# Altium schematic sheet CPU.SchDoc: IC
size A4; DrawnBy: Mauro De Bruyn; Revision: 1; SheetNumber: 2; SheetTotal: 5; Number: PXL Project soldeerbout
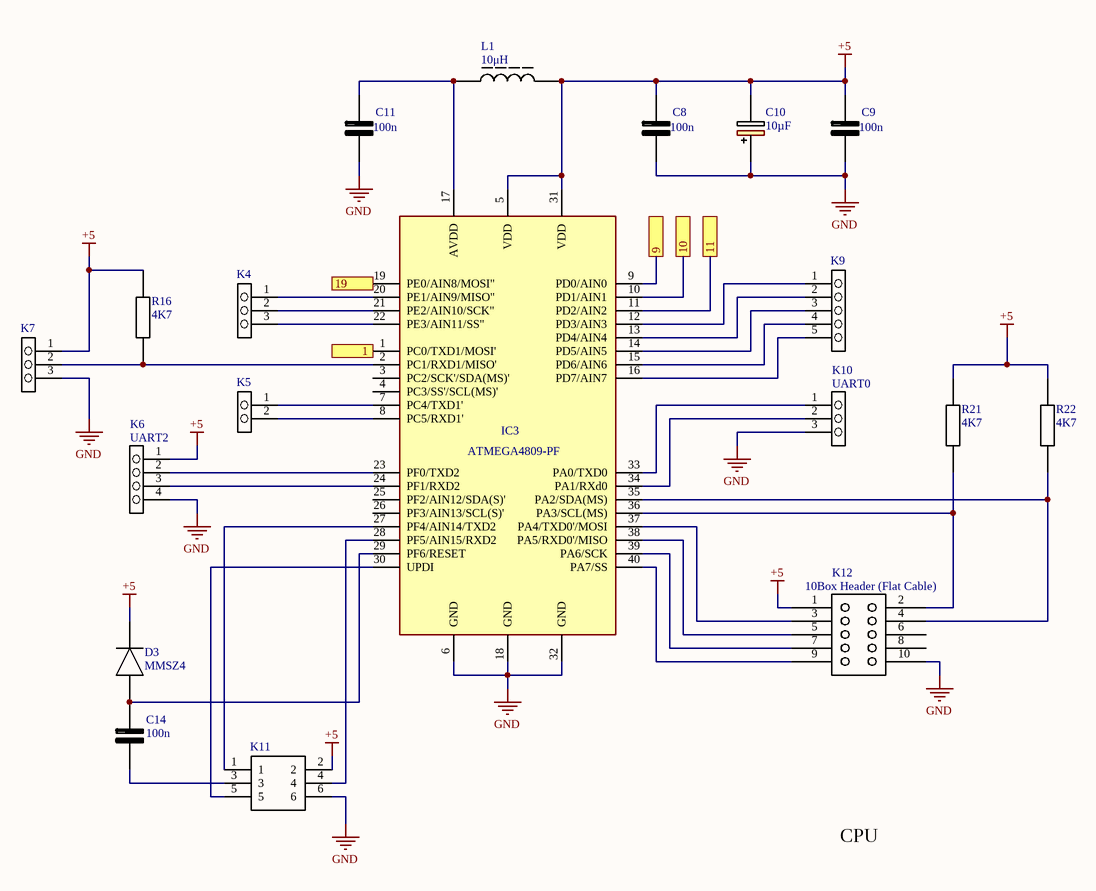
[diagram p0: CPU.SchDoc]

## Parts
C8  100n  [C0805]
C9  100n  [C0805]
C10  10µF  [CAPPRD200W52D500H1250]
C11  100n  [C0805]
C14  100n  [C0805]
D3  MMSZ4  [SOD2512X110N]
IC3  ATMEGA4809-PF  [DIP1543W58P254L5175H635Q40N]
K4  M20-9990345  [HDRV3W64P0X254_1X3_762X254X864P]  (value not drawn)
K5  M20-9990246  [HDRV2W66P0X254_1X2_508X254X874P]  (value not drawn)
K6  UART2  [HDRV4W64P0X254_1X4_1016X254X834P]
K7  M20-9990345  [HDRV3W64P0X254_1X3_762X254X864P]  (value not drawn)
K9  M20-9990545  [HDRV5W64P0X254_1X5_1270X254X864P]  (value not drawn)
K10  UART0  [HDRV3W64P0X254_1X3_762X254X864P]
K11  M20-9760342  [HDRV6W66P254_2X3_762X508X830P]  (value not drawn)
K12  10Box Header (Flat Cable)  [10BoxHeader]
L1  10μH  [VLS56045]
R16  4K7  [C0805]
R21  4K7  [C0805]
R22  4K7  [C0805]

## Ports
1, 9, 10, 11, 19

## Nets
+5: C8.2(-) C9.2(-) C10.2(-) D3.1(K) IC3.5(VDD) IC3.31(VDD) K6.1 K7.1 K11.2 K12.1 L1.2 R16.2 R21.2 R22.2
GND: C8.1(+) C9.1(+) C10.1(+) C11.1(+) IC3.6(GND) IC3.18(GND) IC3.32(GND) K6.4 K7.3 K10.3 K11.6 K12.10
1: IC3.1(PC0/TXD1/MOSI') ; port 1
9: IC3.9(PD0/AIN0) ; port 9
10: IC3.10(PD1/AIN1) ; port 10
11: IC3.11(PD2/AIN2) ; port 11
19: IC3.19(PE0/AIN8/MOSI") ; port 19
NetC11_2: C11.2(-) IC3.17(AVDD) L1.1
NetC14_1: C14.1(+) K11.3
NetC14_2: C14.2(-) D3.2(A) IC3.29(PF6/RESET)
NetIC3_2: IC3.2(PC1/RXD1/MISO') K7.2 R16.1
NetIC3_7: IC3.7(PC4/TXD1') K5.1
NetIC3_8: IC3.8(PC5/RXD1') K5.2
NetIC3_12: IC3.12(PD3/AIN3) K9.1
NetIC3_13: IC3.13(PD4/AIN4) K9.2
NetIC3_14: IC3.14(PD5/AIN5) K9.3
NetIC3_15: IC3.15(PD6/AIN6) K9.4
NetIC3_16: IC3.16(PD7/AIN7) K9.5
NetIC3_20: IC3.20(PE1/AIN9/MISO") K4.1
NetIC3_21: IC3.21(PE2/AIN10/SCK") K4.2
NetIC3_22: IC3.22(PE3/AIN11/SS") K4.3
NetIC3_23: IC3.23(PF0/TXD2) K6.2
NetIC3_24: IC3.24(PF1/RXD2) K6.3
NetIC3_27: IC3.27(PF4/AIN14/TXD2) K11.1
NetIC3_28: IC3.28(PF5/AIN15/RXD2) K11.4
NetIC3_30: IC3.30(UPDI) K11.5
NetIC3_33: IC3.33(PA0/TXD0) K10.1
NetIC3_34: IC3.34(PA1/RXd0) K10.2
NetIC3_35: IC3.35(PA2/SDA(MS)) K12.4 R22.1
NetIC3_36: IC3.36(PA3/SCL(MS)) K12.2 R21.1
NetIC3_37: IC3.37(PA4/TXD0'/MOSI) K12.3
NetIC3_38: IC3.38(PA5/RXD0'/MISO) K12.5
NetIC3_39: IC3.39(PA6/SCK) K12.7
NetIC3_40: IC3.40(PA7/SS) K12.9

Not connected (* = marked no-connect by the designer): IC3 3(PC2/SCK'/SDA(MS)') 4(PC3/SS'/SCL(MS)') 25(PF2/AIN12/SDA(S)') 26(PF3/AIN13/SCL(S)'); K12 6 8

## Notes on the sheet
- CPU

## Library data of the parts
C8 C9 C11 C14 = 0805_1: Capacitor; Manufacturer_Name: Kemet; Manufacturer_Part_Number: C0805C391G3GACTU; Datasheet Link: https://content.kemet.com/datasheets/KEM_C1003_C0G_SMD.pdf; Height: 1.1mm
C10 = 860020672010: Capacitor Polarised; Manufacturer_Name: Wurth Elektronik; Datasheet Link: https://componentsearchengine.com//860020672010.pdf; Height: 12.5mm; Mouser2 Part Number: 710-860020672010; Mouser2 Price/Stock: https://www.mouser.com/Search/Refine.aspx?Keyword=710-860020672010; Manufacturer_Part_Number: 860020672010
D3 = SMMDL914T1G: Diode; Manufacturer_Name: ON Semiconductor; Datasheet Link: https://componentsearchengine.com//SMMDL914T1G.pdf; Height: 1.1mm; Mouser2 Part Number: 863-SMMDL914T1G; Mouser2 Price/Stock: https://www.mouser.com/Search/Refine.aspx?Keyword=863-SMMDL914T1G; Manufacturer_Part_Number: SMMDL914T1G
IC3 = ATMEGA4809-PF: Integrated Circuit; Manufacturer_Name: Microchip; Datasheet Link: https://componentsearchengine.com//ATMEGA4809-PF.pdf; Height: 6.35mm; Mouser2 Part Number: 556-ATMEGA4809-PF; Mouser2 Price/Stock: https://www.mouser.com/Search/Refine.aspx?Keyword=556-ATMEGA4809-PF; Manufacturer_Part_Number: ATMEGA4809-PF
K4 K7 K10 = M20-9990345: Connector 3-PIN; Manufacturer_Name: Harwin; Datasheet Link: https://componentsearchengine.com//M20-9990345.pdf; Height: 8.64mm; Mouser2 Part Number: 855-M20-9990345; Mouser2 Price/Stock: https://www.mouser.com/Search/Refine.aspx?Keyword=855-M20-9990345; Manufacturer_Part_Number: M20-9990345
K5 = M20-9990246: Connector 2-PIN; Manufacturer_Name: Harwin; Datasheet Link: https://componentsearchengine.com//M20-9990246.pdf; Height: 8.74mm; Mouser2 Part Number: 855-M20-9990246; Mouser2 Price/Stock: https://www.mouser.com/Search/Refine.aspx?Keyword=855-M20-9990246; Manufacturer_Part_Number: M20-9990246
K6 = M20-9770446: Connector 4-PIN; Manufacturer_Name: Harwin; Datasheet Link: https://componentsearchengine.com//M20-9770446.pdf; Height: 8.34mm; Mouser2 Part Number: 855-M20-9770446; Mouser2 Price/Stock: https://www.mouser.com/Search/Refine.aspx?Keyword=855-M20-9770446; Manufacturer_Part_Number: M20-9770446
K9 = M20-9990545: Connector 5-PIN; Manufacturer_Name: Harwin; Datasheet Link: https://componentsearchengine.com//M20-9990545.pdf; Height: 8.64mm; Mouser2 Part Number: 855-M20-9990545; Mouser2 Price/Stock: https://www.mouser.com/Search/Refine.aspx?Keyword=855-M20-9990545; Manufacturer_Part_Number: M20-9990545
K11 = M20-9760342: Connector 6-PIN; Manufacturer_Name: Harwin; Datasheet Link: https://cdn.harwin.com/pdfs/M20-976.pdf; Height: 8.3mm; Manufacturer_Part_Number: M20-9760342
L1 = VLS6045EX-100M-H: Inductor; Manufacturer_Name: TDK; Datasheet Link: https://componentsearchengine.com//VLS6045EX-100M-H.pdf; Mouser2 Part Number: 810-VLS6045EX-100M-H; Mouser2 Price/Stock: https://www.mouser.com/Search/Refine.aspx?Keyword=810-VLS6045EX-100M-H; Manufacturer_Part_Number: VLS6045EX-100M-H
R16 R21 R22 = 0805: Resistor; Manufacturer_Name: Kemet; Manufacturer_Part_Number: C0805C391G3GACTU; Datasheet Link: https://content.kemet.com/datasheets/KEM_C1003_C0G_SMD.pdf; Height: 1.1mm